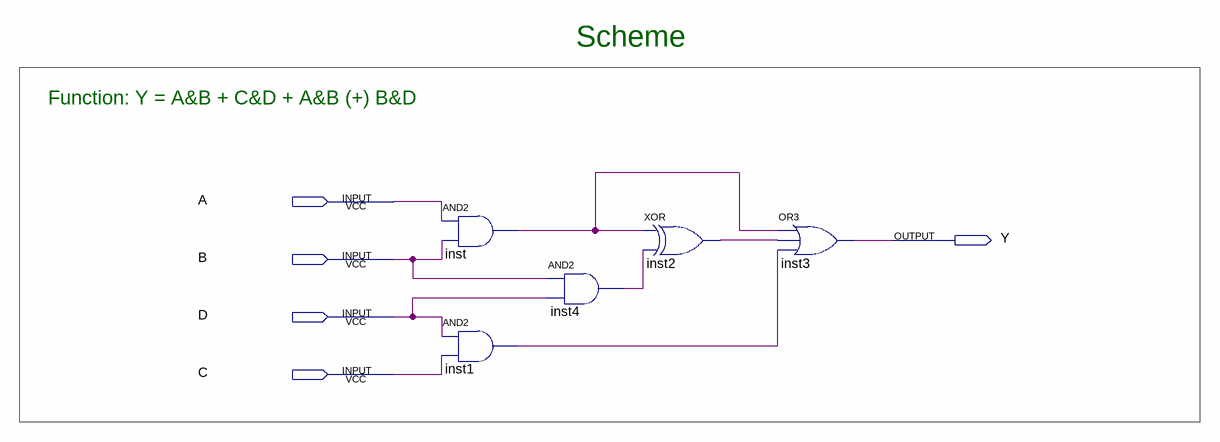
[diagram p0: schematic sheet]
// Quartus schematic Block2.bdf as structural Verilog: 5 symbols, 5 pins
module Block2 (
  input  A,
  input  B,
  input  D,
  input  C,
  output Y
);

  wire inst1_out, inst2_out, inst4_out, inst_out;

  and inst (inst_out, A, B);
  and inst1 (inst1_out, D, C);
  and inst4 (inst4_out, B, D);
  xor inst2 (inst2_out, inst_out, inst4_out);
  or inst3 (Y, inst_out, inst2_out, inst1_out);

  // Notes on the sheet:
  //   Scheme 
  //   Function: Y = A&B + C&D + A&B (+) B&D    
endmodule
